# EAGLE schematic LAB-ASDM300F (EAGLE 6.5.0)
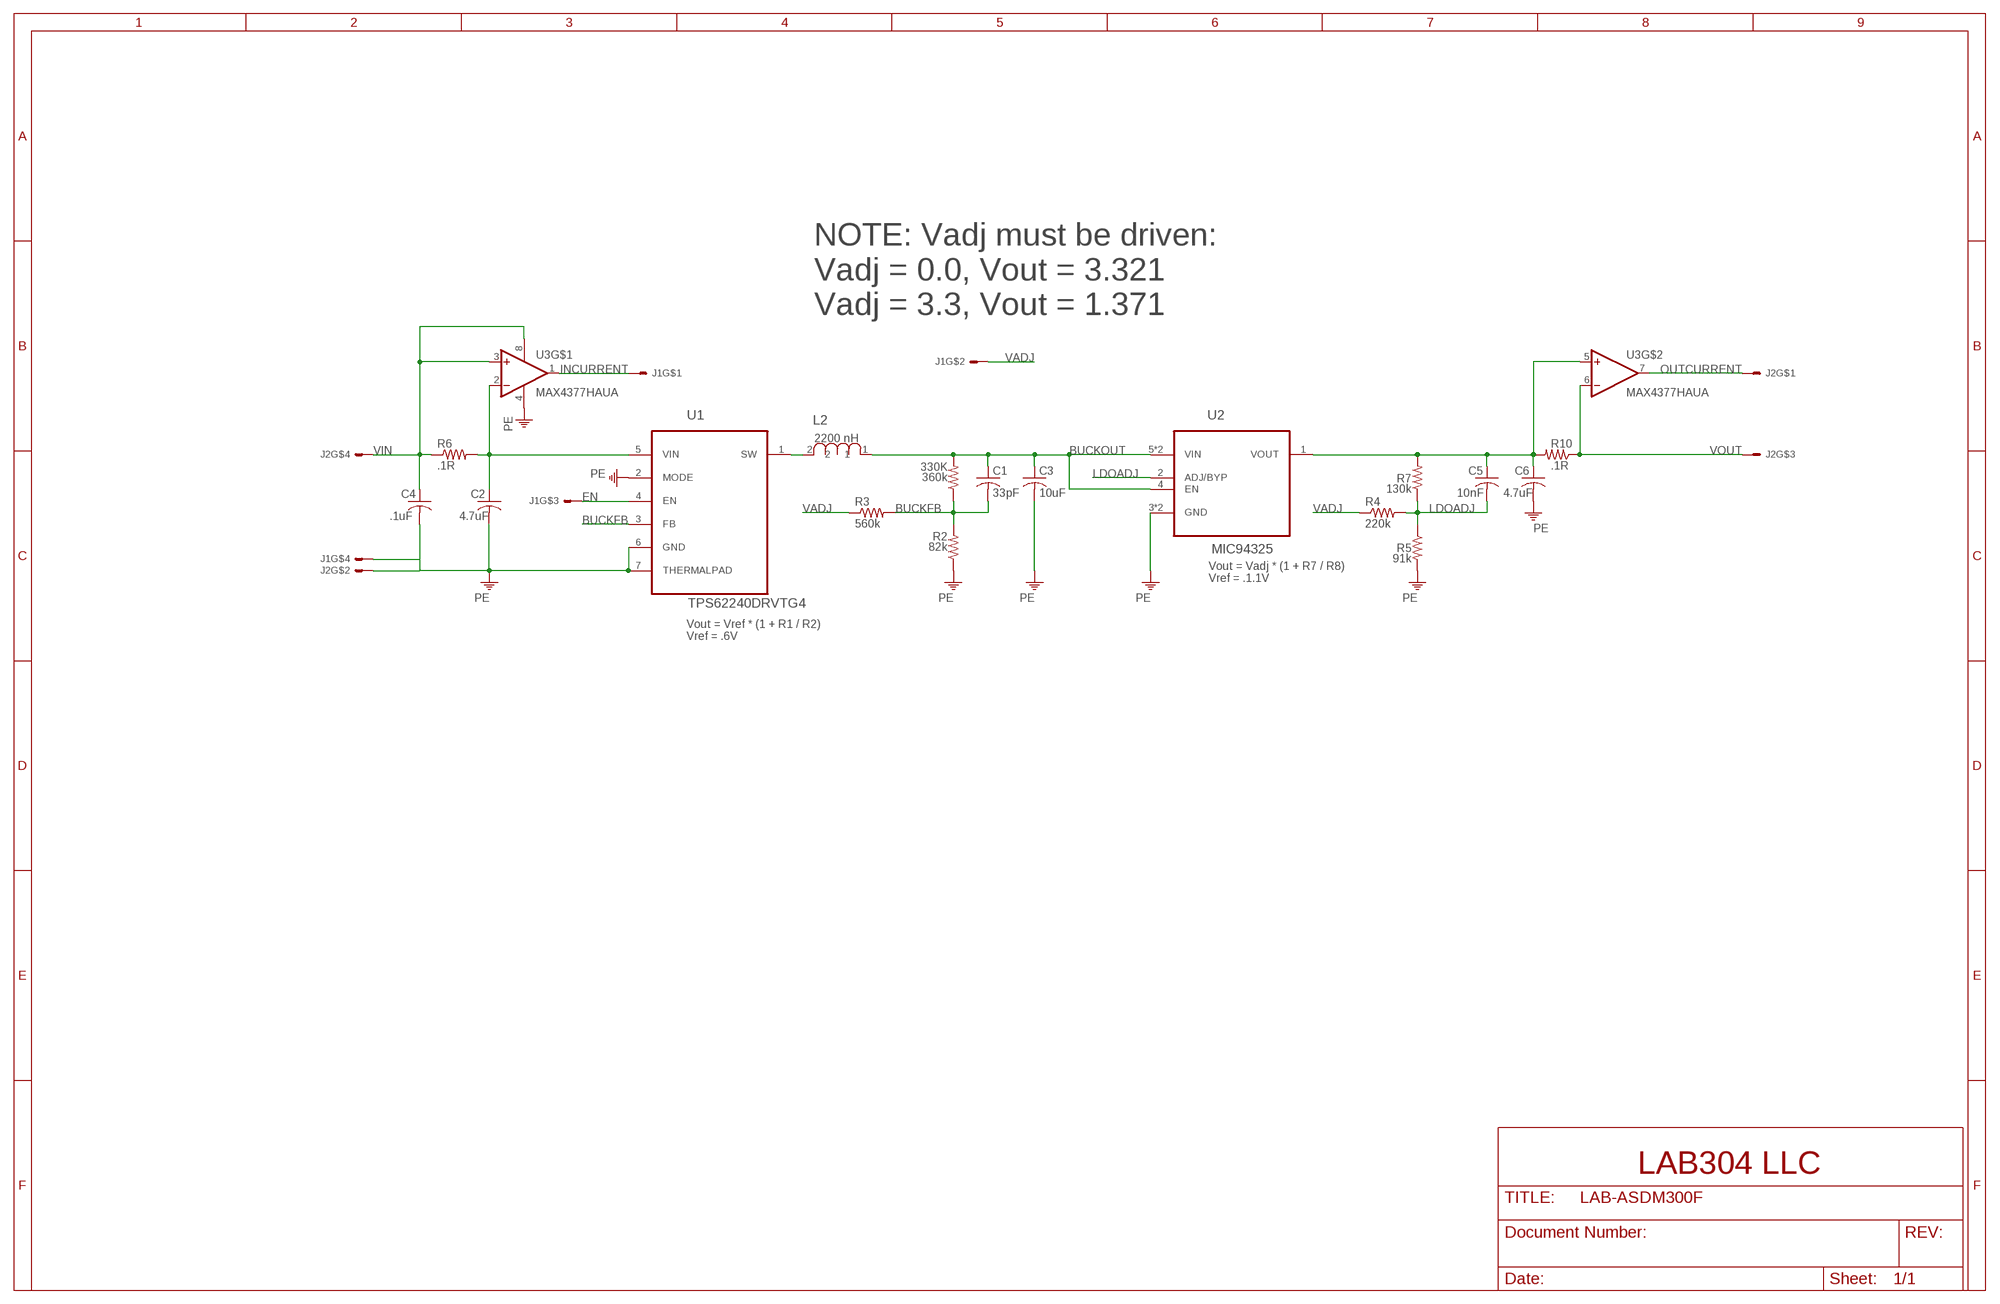
[diagram p0: schematic, sheet 1]

## Parts
330K  360k  R-US_R0603  [R0603]
C1  33pF  C-USC0603  [C0603]
C2  4.7uF  C-USC0603  [C0603]
C3  10uF  C-USC0603  [C0603]
C4  .1uF  C-USC0603  [C0603]
C5  10nF  C-USC0603  [C0603]
C6  4.7uF  C-USC0603  [C0603]
J1  SULLINSSMTHEADER-4  [SMTHEADER-4]
J2  SULLINSSMTHEADER-4  [SMTHEADER-4]
L2  2200 nH  PM1008-2R2K-RC  [INDC2520X18N]
R2  82k  R-US_R0603  [R0603]
R3  560k  R-US_R0603  [R0603]
R4  220k  R-US_R0603  [R0603]
R5  91k  R-US_R0603  [R0603]
R6  .1R  R-US_R0603  [R0603]
R7  130k  R-US_R0603  [R0603]
R10  .1R  R-US_R0603  [R0603]
U1  TPS62240DRVTG4  [SON65P210X210X80-7N]
U2  MIC94325  [SON65P160X160X80-7N]
U3  MAX4377HAUA  MAX4377  [UMAX8]

## Nets
BUCKFB: 330K.1 C1.2 R2.2 R3.2 U1.3(FB)
BUCKOUT: 330K.2 C1.1 C3.1 L2.1 U2.4(EN) U2.5(VIN) U2.6(VIN)
EN: J1.P$3 U1.4(EN)
INCURRENT: J1.P$1 U3.1(OUT)
LDOADJ: C5.2 R4.2 R5.1 R7.1 U2.2(ADJ/BYP)
N$1: L2.2 U1.1(SW)
N$3: C2.1 R6.2 U1.5(VIN) U3.2(-IN)
N$4: C5.1 C6.1 R7.2 R10.2 U2.1(VOUT) U3.5(+IN)
OUTCURRENT: J2.P$1 U3.7(OUT)
PE: C2.2 C3.2 C4.2 C6.2 J1.P$4 J2.P$2 R2.1 R5.2 U1.2(MODE) U1.6(GND) U1.7(THERMALPAD) U2.3(GND) U2.7(GND) U3.4(V-)
VADJ: J1.P$2 R3.1 R4.1
VIN: C4.1 J2.P$4 R6.1 U3.3(+IN) U3.8(V+)
VOUT: J2.P$3 R10.1 U3.6(-IN)

## Notes on the sheet
- NOTE: Vadj must be driven:
  Vadj = 0.0, Vout = 3.321
  Vadj = 3.3, Vout = 1.371
- Vout = Vadj * (1 + R7 / R8)
  Vref = .1.1V
- Vout = Vref * (1 + R1 / R2)
  Vref = .6V
- LAB304 LLC

## Library data of the parts
330K R2-R7 R10 = rcl:R-US_: RESISTOR, American symbol
C1-C6 = rcl:C-US: CAPACITOR, American symbol
J1 J2 = LAB-ASDM300F:SULLINSSMTHEADER-4
L2 = Bourns_By_element14_Batch_1:PM1008-2R2K-RC: CHIP INDUCTOR; MPN: PM1008-2R2K-RC; OC_FARNELL: -; OC_NEWARK: 63K3050; SUPPLIER: BOURNS; TOLERANCE: ±10 %
U1 = Texas Instruments_By_element14_Batch_1:TPS62240DRVTG4: 2.25 MHz 300 mA Step Down Converter in 2x2SON/TSOT23 Package; MPN: TPS62240DRVTG4; OC_FARNELL: 1511851; OC_NEWARK: 59M7215; PACKAGE: SON-6; SUPPLIER: Texas Instruments
U2 = My Library-adm:MIC94325
U3 = My Library-adm:MAX4377